# EAGLE schematic Top_Board_Boundary_Ref (EAGLE 7.4.0)
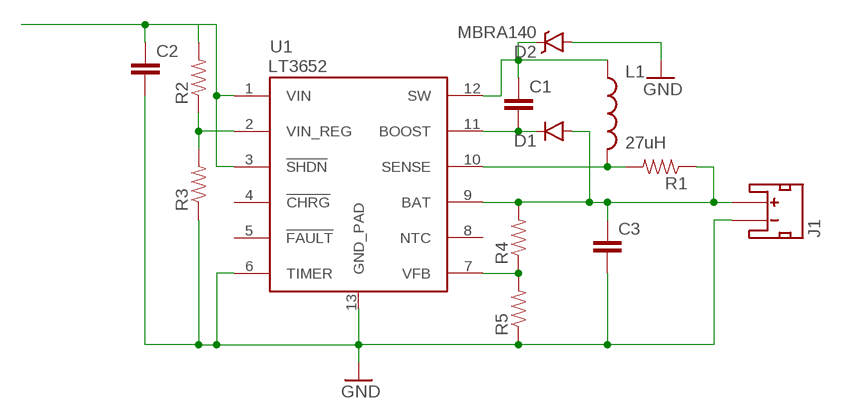
[diagram p0: schematic, sheet 1]

## Parts
C1  CAP0805  [0805]
C2  CAP0805  [0805]
C3  CAP0805  [0805]
D1  DIODESMA  [SMA-DIODE]
D2  MBRA140  DIODE-SCHOTTKY-MBRA140  [SMA-DIODE]
J1  JST_2MM_MALE  [JST-2-SMD]
L1  27uH  INDUCTORSDR13-7-270ML  [INDUCTOR_SDR1307]
R1  RESISTOR0805-RES  [0805]
R2  RESISTOR0805-RES  [0805]
R3  RESISTOR0805-RES  [0805]
R4  RESISTOR0805-RES  [0805]
R5  RESISTOR0805-RES  [0805]
U1  LT3652  [MSOP-12_GND]

## Nets
GND: C2.2 C3.2 D2.A J1.1(-) R3.1 R5.1 U1.6(TIMER) U1.13(GND_PAD)
N$1: R4.1 R5.2 U1.7(VFB)
N$2: C3.1 D1.A J1.2(+) R1.1 R4.2 U1.9(BAT)
N$3: C1.1 D2.C L1.P$1 U1.12(SW)
N$4: C2.1 R2.2 U1.1(VIN) U1.3(!SHDN)
N$5: R2.1 R3.2 U1.2(VIN_REG)
N$6: C1.2 D1.C U1.11(BOOST)
N$8: L1.P$2 R1.2 U1.10(SENSE)
Unconnected: J1.NC1(PAD1) J1.NC2(PAD2) U1.4(!CHRG) U1.5(!FAULT) U1.8(NTC)

## Library data of the parts
C1-C3 = SparkFun-Passives:CAP: Capacitor Standard 0603 ceramic capacitor, and 0.1" leaded capacitor.
D1 = SparkFun-DiscreteSemi:DIODE: Diode These are standard reverse protection diodes and small signal diodes. SMA package can handle up to about 1A. SOD-323 can handle about 200mA. What the SOD-323 package when ordering, there are some mfgs out there that are 5-pin packages.
D2 = SparkFun-DiscreteSemi:DIODE-SCHOTTKY: Schottky diodes in SFE's production catalog BAT20J 1A 23V 0.62Vf RB751 120mA 40V 0.37Vf PMEG4005EJ 0.5A 40V 0.42Vf MBRA140 1A 40V 0.5Vf B340A 3A 40V SMA; PROD_ID: DIO-08053
J1 = SparkFun-Connectors:JST_2MM_MALE: Mates to single-cell LiPo batteries. CONN-11443 Now with smashable polarity marks!; BTM_NEG: -; BTM_POS: +; PROD_ID: CONN-11443; TOP_NEG: -; TOP_POS: +
L1 = SparkFun-Passives:INDUCTOR: Inductors Basic Inductor/Choke - 0603 and 1206. Footprints are not proven and vary greatly between part numbers. INDUCTOR POWER 3.3UH 4.0A SMD 0.197" L x 0.197" W x 0.177" H (5.00mm x 5.00mm x 4.50mm); PROD_ID: NDUC-12529
R1-R5 = SparkFun-Passives:RESISTOR: Resistor Basic schematic elements and footprints for 0603, 1206, and PTH resistors.
U1 = SparkFun-PowerIC:LT3652: LT3652 MPPT Solar Charge Controller 5V-32V smart charger for batteries up to 14.4V